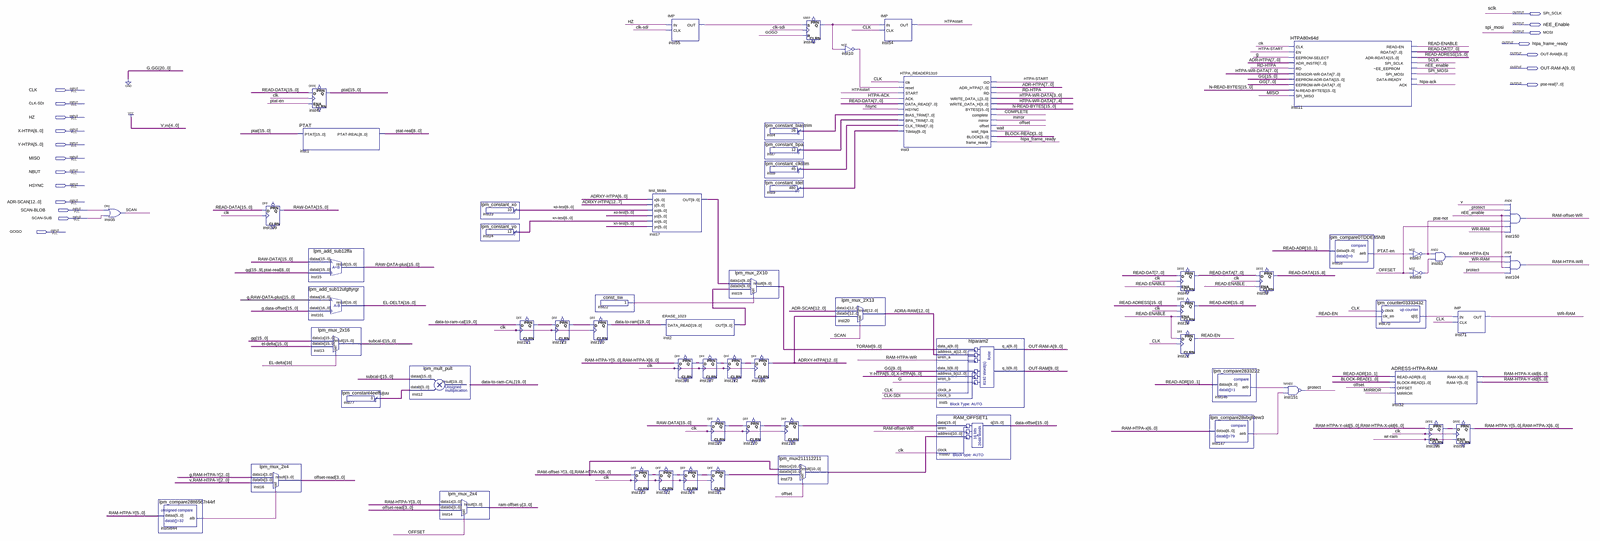
[diagram p0: schematic sheet, whole]
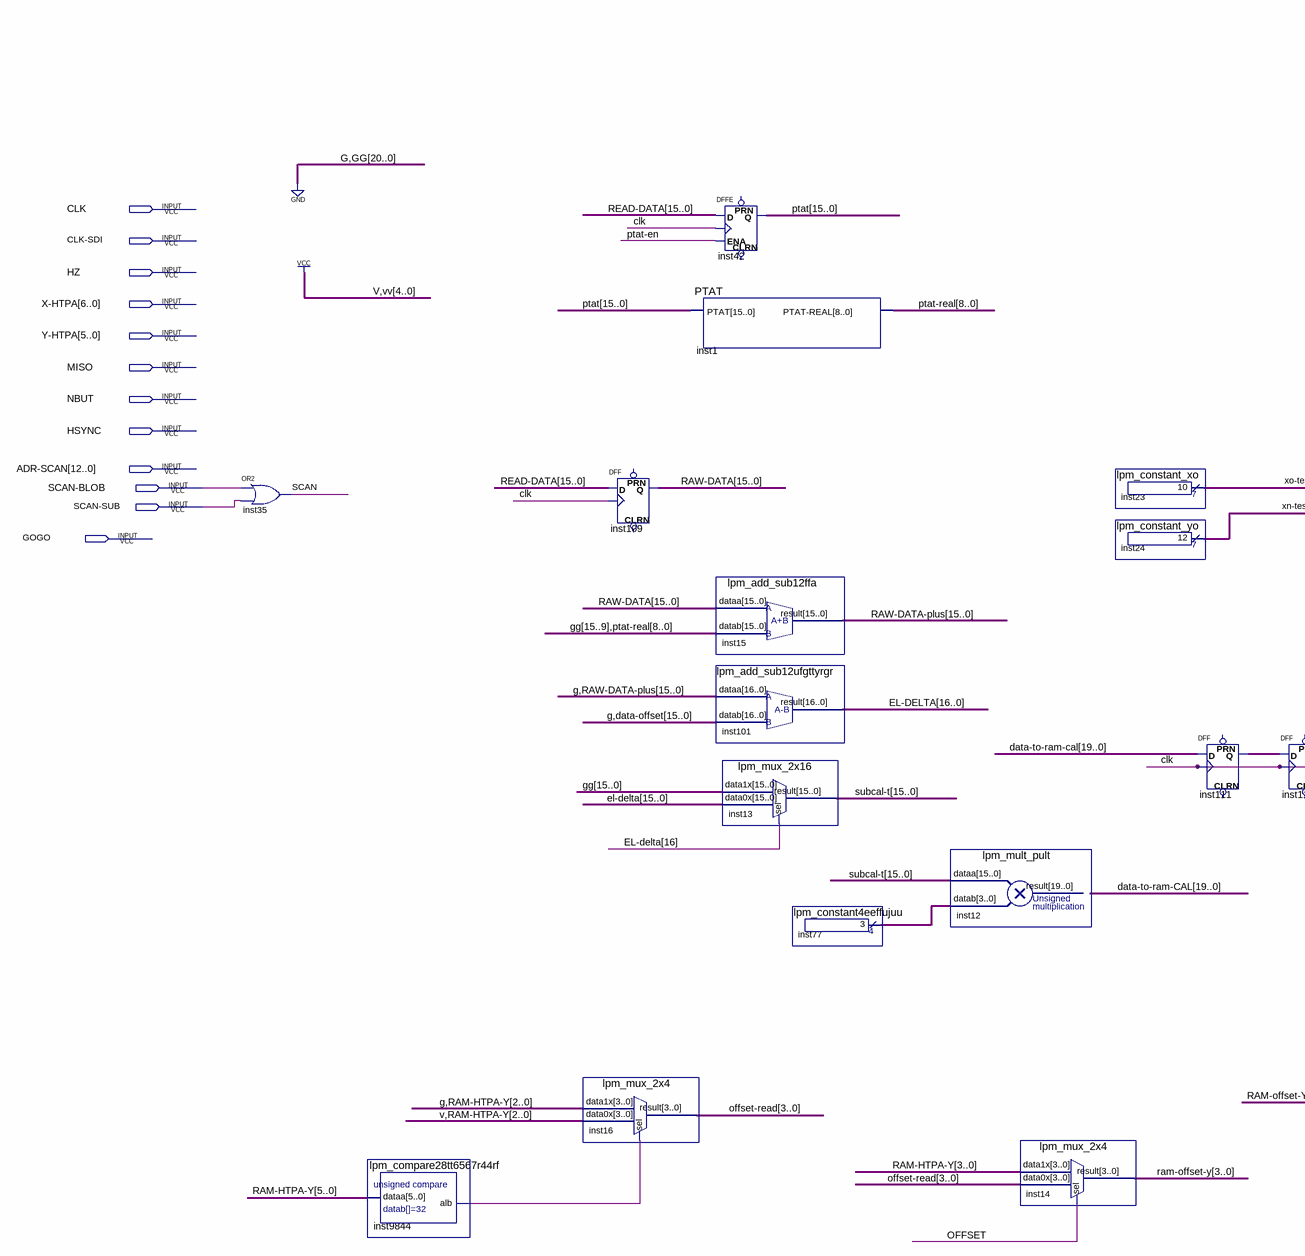
[diagram p1: schematic sheet, left part]
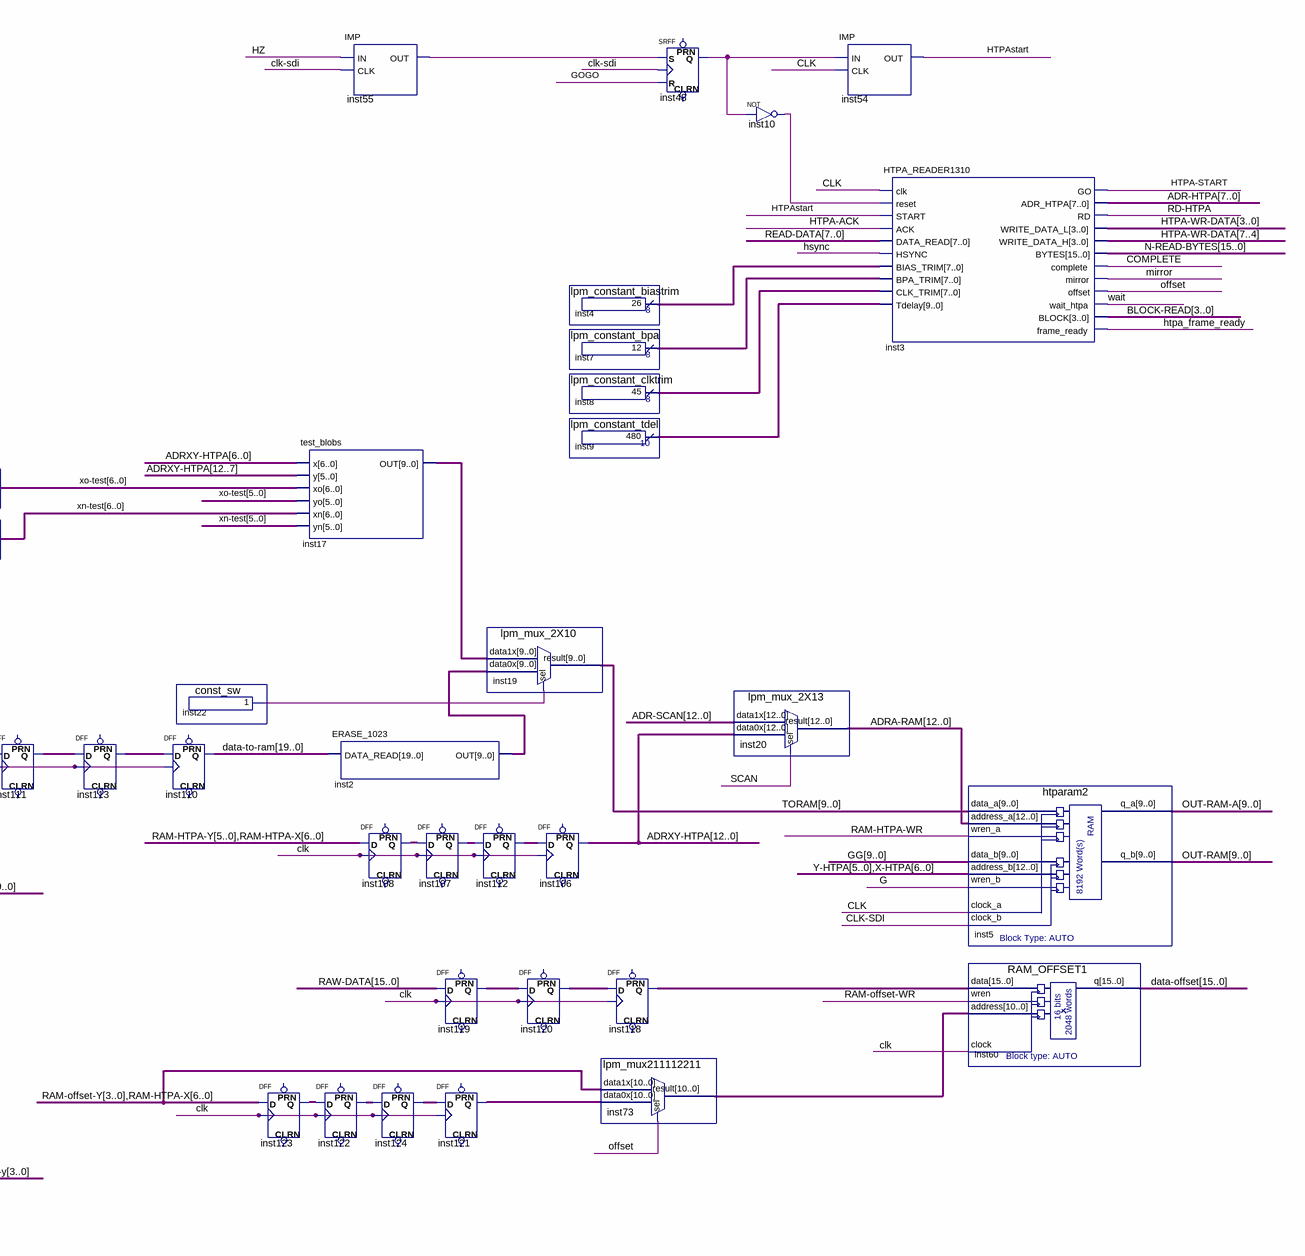
[diagram p2: schematic sheet, centre part]
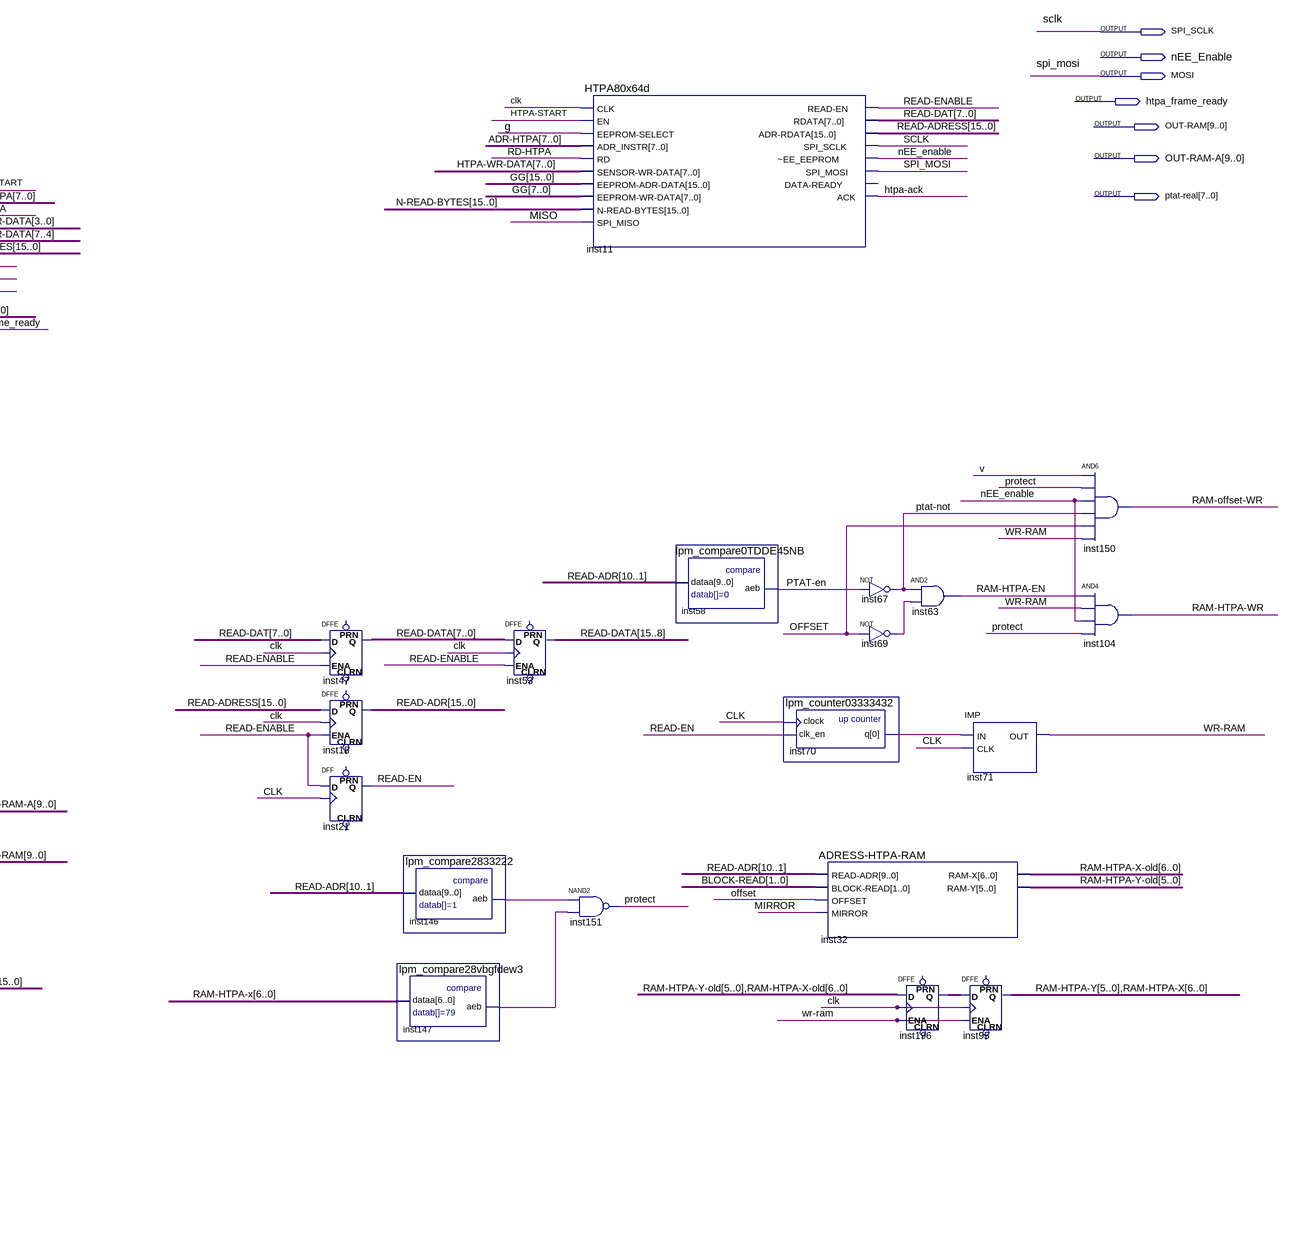
[diagram p3: schematic sheet, right part]
// Quartus schematic HTPA_MAIN.bdf as structural Verilog: 64 symbols, 19 pins
module HTPA_MAIN (
  input  CLK,
  input  \CLK-SDI ,
  input  HZ,
  input  [6:0] \X-HTPA ,
  input  [5:0] \Y-HTPA ,
  input  MISO,
  input  NBUT,
  input  HSYNC,
  input  [12:0] \ADR-SCAN ,
  input  \SCAN-BLOB ,
  input  \SCAN-SUB ,
  input  GOGO,
  output SPI_SCLK,
  output nEE_Enable,
  output MOSI,
  output htpa_frame_ready,
  output [9:0] \OUT-RAM ,
  output [9:0] \OUT-RAM-A ,
  output [8:0] \ptat-real 
);

  wire COMPLETE, \HTPA-ACK , \HTPA-START , HTPAstart, inst10_out, inst22_result, inst48_q, inst55_out,
       inst69_out, inst70_q, inst146_aeb, inst147_aeb, inst9844_alb, MIRROR, offset, protect, \PTAT-en ,
       \ptat-not , \RAM-HTPA-EN , \RAM-HTPA-WR , \RAM-offset-WR , \RD-HTPA , \READ-EN , \READ-ENABLE , SCAN,
       \wait , \WR-RAM ;
  wire [3:0] \BLOCK-READ , inst77_result, \offset-read , \ram-offset-y ;
  wire [5:0] \RAM-HTPA-Y , \RAM-HTPA-Y-old ;
  wire [6:0] \RAM-HTPA-X , \RAM-HTPA-X-old , \xn-test , \xo-test ;
  wire [7:0] \ADR-HTPA , \HTPA-WR-DATA , inst4_result, inst7_result, inst8_result, \READ-DAT ;
  wire [9:0] inst2_out, inst9_result, inst17_out, TORAM;
  wire [10:0] inst73_result, inst121_q, inst122_q, inst123_q, inst124_q;
  wire [12:0] \ADRA-RAM , \ADRXY-HTPA , inst107_q, inst108_q, inst112_q, inst196_q;
  wire [15:0] \data-offset , inst118_q, inst119_q, inst120_q, \N-READ-BYTES , ptat, \RAW-DATA ,
       \RAW-DATA-plus , \READ-ADR , \READ-ADRESS , \READ-DATA , \subcal-t ;
  wire [16:0] \EL-delta ;
  wire [19:0] \data-to-ram , \data-to-ram-CAL , inst111_q, inst113_q;

  or inst35 (SCAN, \SCAN-BLOB , \SCAN-SUB );
  lpm_compare28tt6567r44rf inst9844 (.dataa(\RAM-HTPA-Y ), .alb(inst9844_alb));
  lpm_mux_2x4 inst16 (
    .data1x({1'b0, \RAM-HTPA-Y [2:0]}), .data0x({1'b1, \RAM-HTPA-Y [2:0]}), .sel(inst9844_alb),
    .result(\offset-read ));
  DFF inst109[15:0] (.CLK(CLK), .D(\READ-DATA ), .Q(\RAW-DATA ));  // open: CLRN, PRN
  PTAT inst1 (.PTAT(ptat), .\PTAT-REAL (\ptat-real ));
  DFFE inst42[15:0] (.D(\READ-DATA ), .CLK(CLK), .ENA(\PTAT-en ), .Q(ptat));  // open: PRN, CLRN
  lpm_add_sub12ffa inst15 (.dataa(\RAW-DATA ), .datab({{7{1'b0}}, \ptat-real }), .result(\RAW-DATA-plus ));
  lpm_add_sub12ufgttyrgr inst101 (.dataa({1'b0, \RAW-DATA-plus }), .datab({1'b0, \data-offset }), .result(\EL-delta ));
  lpm_mux_2x16 inst13 (.data1x({16{1'b0}}), .data0x(\EL-delta [15:0]), .sel(\EL-delta [16]), .result(\subcal-t ));
  lpm_constant4eeffujuu inst77 (.result(inst77_result));
  lpm_mult_pult inst12 (.dataa(\subcal-t ), .datab(inst77_result), .result(\data-to-ram-CAL ));
  lpm_mux_2x4 inst14 (.data1x(\RAM-HTPA-Y [3:0]), .data0x(\offset-read ), .sel(offset), .result(\ram-offset-y ));
  lpm_constant_xo inst23 (.result(\xo-test ));
  lpm_constant_yo inst24 (.result(\xn-test ));
  DFF inst111[19:0] (.CLK(CLK), .D(\data-to-ram-CAL ), .Q(inst111_q));  // open: CLRN, PRN
  DFF inst113[19:0] (.CLK(CLK), .D(inst111_q), .Q(inst113_q));  // open: CLRN, PRN
  const_sw inst22 (.result(inst22_result));
  DFF inst110[19:0] (.CLK(CLK), .D(inst113_q), .Q(\data-to-ram ));  // open: CLRN, PRN
  DFF inst123[10:0] (.CLK(CLK), .D({\ram-offset-y , \RAM-HTPA-X }), .Q(inst123_q));  // open: CLRN, PRN
  test_blobs inst17 (
    .x(\ADRXY-HTPA [6:0]), .y(\ADRXY-HTPA [12:7]), .xo(\xo-test ), .yo(\xo-test [5:0]), .xn(\xn-test ),
    .yn(\xn-test [5:0]), .OUT(inst17_out));
  IMP inst55 (.IN(HZ), .CLK(\CLK-SDI ), .OUT(inst55_out));
  ERASE_1023 inst2 (.DATA_READ(\data-to-ram ), .OUT(inst2_out));
  DFF inst108[12:0] (.CLK(CLK), .D({\RAM-HTPA-Y , \RAM-HTPA-X }), .Q(inst108_q));  // open: CLRN, PRN
  DFF inst122[10:0] (.CLK(CLK), .D(inst123_q), .Q(inst122_q));  // open: CLRN, PRN
  DFF inst124[10:0] (.CLK(CLK), .D(inst122_q), .Q(inst124_q));  // open: CLRN, PRN
  DFF inst107[12:0] (.CLK(CLK), .D(inst108_q), .Q(inst107_q));  // open: CLRN, PRN
  DFF inst119[15:0] (.CLK(CLK), .D(\RAW-DATA ), .Q(inst119_q));  // open: CLRN, PRN
  DFF inst121[10:0] (.CLK(CLK), .D(inst124_q), .Q(inst121_q));  // open: CLRN, PRN
  lpm_mux_2X10 inst19 (.data1x(inst17_out), .data0x(inst2_out), .sel(inst22_result), .result(TORAM));
  DFF inst112[12:0] (.CLK(CLK), .D(inst107_q), .Q(inst112_q));  // open: CLRN, PRN
  DFF inst106[12:0] (.CLK(CLK), .D(inst112_q), .Q(\ADRXY-HTPA ));  // open: CLRN, PRN
  DFF inst120[15:0] (.CLK(CLK), .D(inst119_q), .Q(inst120_q));  // open: CLRN, PRN
  lpm_constant_biastrim inst4 (.result(inst4_result));
  lpm_constant_bpa inst7 (.result(inst7_result));
  lpm_constant_clktrim inst8 (.result(inst8_result));
  lpm_constant_tdel inst9 (.result(inst9_result));
  DFF inst118[15:0] (.CLK(CLK), .D(inst120_q), .Q(inst118_q));  // open: CLRN, PRN
  lpm_mux211112211 inst73 (
    .data1x({\ram-offset-y , \RAM-HTPA-X }), .data0x(inst121_q), .sel(offset), .result(inst73_result));
  SRFF inst48 (.S(inst55_out), .R(GOGO), .CLK(\CLK-SDI ), .Q(inst48_q));  // open: PRN, CLRN
  not inst10 (inst10_out, inst48_q);
  lpm_mux_2X13 inst20 (.data1x(\ADR-SCAN ), .data0x(\ADRXY-HTPA ), .sel(SCAN), .result(\ADRA-RAM ));
  IMP inst54 (.IN(inst48_q), .CLK(CLK), .OUT(HTPAstart));
  HTPA_READER1310 inst3 (
    .clk(CLK), .reset(inst10_out), .START(HTPAstart), .ACK(\HTPA-ACK ), .DATA_READ(\READ-DATA [7:0]),
    .HSYNC(HSYNC), .BIAS_TRIM(inst4_result), .BPA_TRIM(inst7_result), .CLK_TRIM(inst8_result),
    .Tdelay(inst9_result), .GO(\HTPA-START ), .ADR_HTPA(\ADR-HTPA ), .RD(\RD-HTPA ),
    .WRITE_DATA_L(\HTPA-WR-DATA [3:0]), .WRITE_DATA_H(\HTPA-WR-DATA [7:4]), .BYTES(\N-READ-BYTES ),
    .complete(COMPLETE), .mirror(MIRROR), .offset(offset), .wait_htpa(\wait ), .BLOCK(\BLOCK-READ ),
    .frame_ready(htpa_frame_ready));
  htparam2 inst5 (
    .data_a(TORAM), .address_a(\ADRA-RAM ), .wren_a(\RAM-HTPA-WR ), .data_b({10{1'b0}}),
    .address_b({\Y-HTPA , \X-HTPA }), .wren_b(1'b0), .clock_a(CLK), .clock_b(\CLK-SDI ), .q_a(\OUT-RAM-A ),
    .q_b(\OUT-RAM ));
  RAM_OFFSET1 inst60 (
    .data(inst118_q), .wren(\RAM-offset-WR ), .address(inst73_result), .clock(CLK), .q(\data-offset ));
  DFFE inst47[7:0] (.D(\READ-DAT ), .CLK(CLK), .ENA(\READ-ENABLE ), .Q(\READ-DATA [7:0]));  // open: PRN, CLRN
  DFFE inst18[15:0] (.D(\READ-ADRESS ), .CLK(CLK), .ENA(\READ-ENABLE ), .Q(\READ-ADR ));  // open: PRN, CLRN
  DFF inst21 (.CLK(CLK), .D(\READ-ENABLE ), .Q(\READ-EN ));  // open: CLRN, PRN
  lpm_compare2833222 inst146 (.dataa(\READ-ADR [10:1]), .aeb(inst146_aeb));
  lpm_compare28vbgfdew3 inst147 (.dataa(\RAM-HTPA-X ), .aeb(inst147_aeb));
  DFFE inst53[7:0] (.D(\READ-DATA [7:0]), .CLK(CLK), .ENA(\READ-ENABLE ), .Q(\READ-DATA [15:8]));  // open: PRN, CLRN
  nand inst151 (protect, inst146_aeb, inst147_aeb);
  HTPA80x64d inst11 (
    .CLK(CLK), .EN(\HTPA-START ), .\EEPROM-SELECT (1'b0), .ADR_INSTR(\ADR-HTPA ), .RD(\RD-HTPA ),
    .\SENSOR-WR-DATA (\HTPA-WR-DATA ), .\EEPROM-ADR-DATA ({16{1'b0}}), .\EEPROM-WR-DATA ({8{1'b0}}),
    .\N-READ-BYTES (\N-READ-BYTES ), .SPI_MISO(MISO), .\READ-EN (\READ-ENABLE ), .RDATA(\READ-DAT ),
    .\ADR-RDATA (\READ-ADRESS ), .SPI_SCLK(SPI_SCLK), .\~EE_EEPROM (nEE_Enable), .SPI_MOSI(MOSI),
    .ACK(\HTPA-ACK ));  // open: DATA-READY
  lpm_compare0TDDE45NB inst58 (.dataa(\READ-ADR [10:1]), .aeb(\PTAT-en ));
  lpm_counter03333432 inst70 (.clock(CLK), .clk_en(\READ-EN ), .q(inst70_q));
  \ADRESS-HTPA-RAM  inst32 (
    .\READ-ADR (\READ-ADR [10:1]), .\BLOCK-READ (\BLOCK-READ [1:0]), .OFFSET(offset), .MIRROR(MIRROR),
    .\RAM-X (\RAM-HTPA-X-old ), .\RAM-Y (\RAM-HTPA-Y-old ));
  not inst67 (\ptat-not , \PTAT-en );
  not inst69 (inst69_out, offset);
  and inst63 (\RAM-HTPA-EN , \ptat-not , inst69_out);
  DFFE inst196[12:0] (
    .D({\RAM-HTPA-Y-old , \RAM-HTPA-X-old }), .CLK(CLK), .ENA(\WR-RAM ), .Q(inst196_q));  // open: PRN, CLRN
  IMP inst71 (.IN(inst70_q), .CLK(CLK), .OUT(\WR-RAM ));
  DFFE inst95[12:0] (.D(inst196_q), .CLK(CLK), .ENA(\WR-RAM ), .Q({\RAM-HTPA-Y , \RAM-HTPA-X }));  // open: PRN, CLRN
  and inst150 (\RAM-offset-WR , 1'b1, protect, nEE_Enable, \ptat-not , offset, \WR-RAM );
  and inst104 (\RAM-HTPA-WR , \RAM-HTPA-EN , \WR-RAM , nEE_Enable, protect);

  // Other names for the same wires on the sheet: sclk = SPI_SCLK; spi_mosi = MOSI
endmodule
